# EAGLE design uArm_back_print (EAGLE 9.5.1)
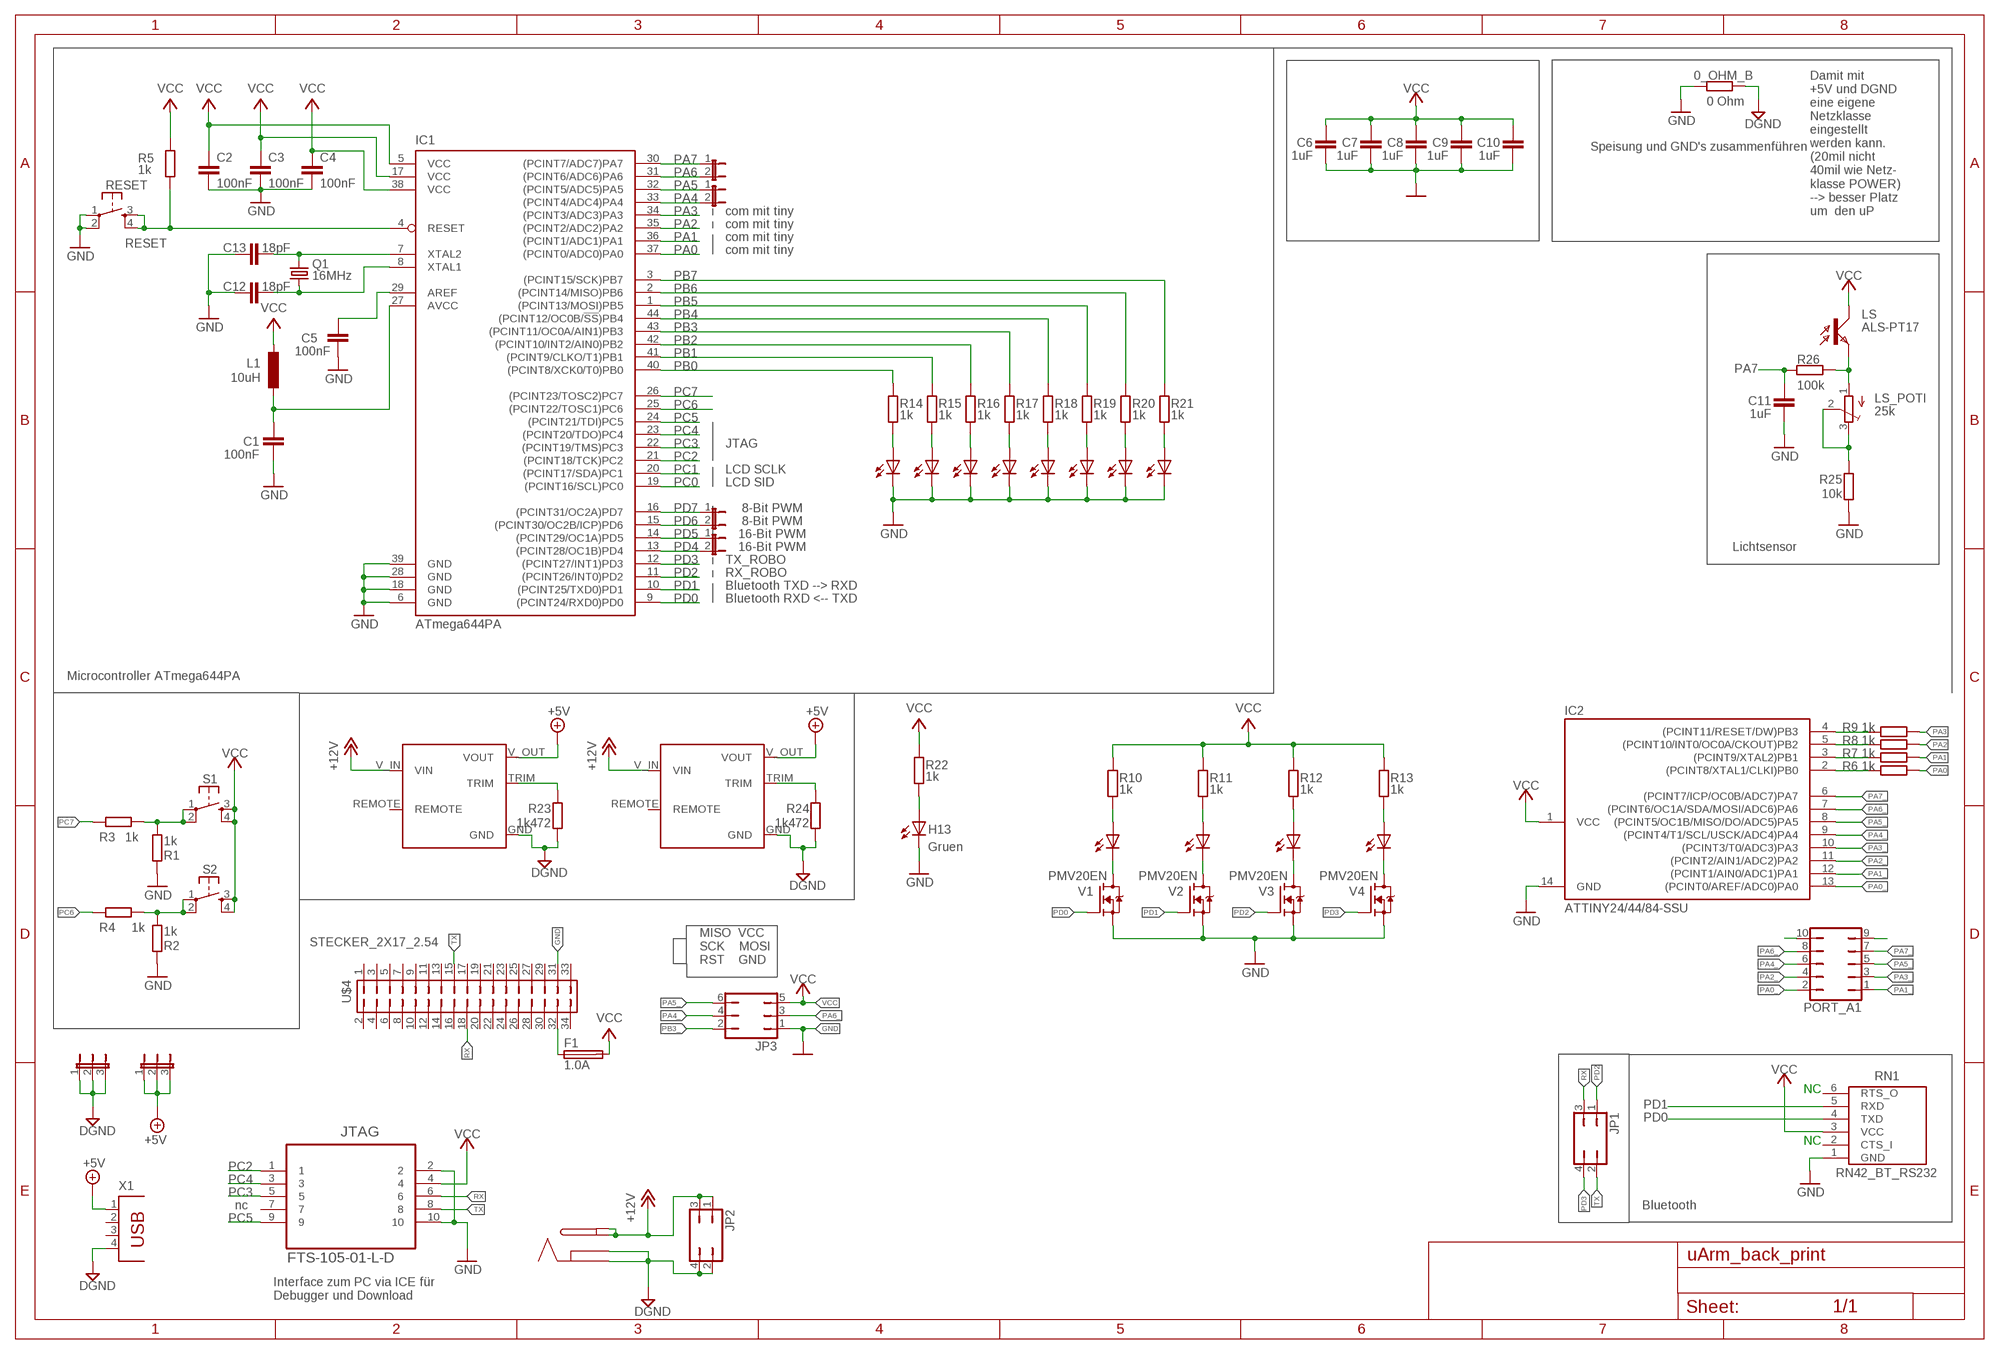
[diagram p0: schematic, sheet 1]

## Parts
0_OHM_B  0 Ohm  R-EU_R0805  [R0805]
C1  100nF  C-EUC0805  [C0805]
C2  100nF  C-EUC0805  [C0805]
C3  100nF  C-EUC0805  [C0805]
C4  100nF  C-EUC0805  [C0805]
C5  100nF  C-EUC0805  [C0805]
C6  1uF  C-EUC0805  [C0805]
C7  1uF  C-EUC0805  [C0805]
C8  1uF  C-EUC0805  [C0805]
C9  1uF  C-EUC0805  [C0805]
C10  1uF  C-EUC0805  [C0805]
C11  1uF  C-EUC0805  [C0805]
C12  18pF  C-EUC0805  [C0805]
C13  18pF  C-EUC0805  [C0805]
F1  1.0A  195601206  [F1206]
H1  Gruen  LEDCHIPLED_1206  [CHIPLED_1206]
H2  Gruen  LEDCHIPLED_1206  [CHIPLED_1206]
H3  Gruen  LEDCHIPLED_1206  [CHIPLED_1206]
H4  Gruen  LEDCHIPLED_1206  [CHIPLED_1206]
H5  Gruen  LEDCHIPLED_1206  [CHIPLED_1206]
H6  Gruen  LEDCHIPLED_1206  [CHIPLED_1206]
H7  Gruen  LEDCHIPLED_1206  [CHIPLED_1206]
H8  Gruen  LEDCHIPLED_1206  [CHIPLED_1206]
H9  Gruen  LEDCHIPLED_1206  [CHIPLED_1206]
H10  Gruen  LEDCHIPLED_1206  [CHIPLED_1206]
H11  Gruen  LEDCHIPLED_1206  [CHIPLED_1206]
H12  Gruen  LEDCHIPLED_1206  [CHIPLED_1206]
H13  Gruen  LEDCHIPLED_1206  [CHIPLED_1206]
IC1  ATmega644PA  ATMEGA644A  [TQFP44]
IC2  ATTINY24/44/84-SSU  [SOIC14]
IC3  DCDC  [1X2,3_2.54MM]
IC4  DCDC  [1X2,3_2.54MM]
JP1  JP2Q  [JP2Q]
JP2  JP2Q  [JP2Q]
JP3  JP3Q  [JP3Q]
JP4  JP1E  [JP1]
JP5  JP1E  [JP1]
JP6  JP2E  [JP2]
JP7  JP2E  [JP2]
JP8  JP1E  [JP1]
JP9  JP1E  [JP1]
JTAG  FTS-105-01-L-D  [SAMTEC_FTS-105-01-L-D]
L1  10uH  L-EUL2825P  [L2825P]
LS  ALS-PT17  ALS-PT17-51C  [SOD232-W]
LS_POTI  25k  TRIM_EU-3223G  [3223G]
PORT_A1  JP5Q  [JP5Q]
Q1  16MHz  CRYSTALHC49UP  [HC49UP]
R1  1k  R-EU_R0805  [R0805]
R2  1k  R-EU_R0805  [R0805]
R3  1k  R-EU_R0805  [R0805]
R4  1k  R-EU_R0805  [R0805]
R5  1k  R-EU_R0805  [R0805]
R6  1k  R-EU_R0805  [R0805]
R7  1k  R-EU_R0805  [R0805]
R8  1k  R-EU_R0805  [R0805]
R9  1k  R-EU_R0805  [R0805]
R10  1k  R-EU_R0805  [R0805]
R11  1k  R-EU_R0805  [R0805]
R12  1k  R-EU_R0805  [R0805]
R13  1k  R-EU_R0805  [R0805]
R14  1k  R-EU_R0805  [R0805]
R15  1k  R-EU_R0805  [R0805]
R16  1k  R-EU_R0805  [R0805]
R17  1k  R-EU_R0805  [R0805]
R18  1k  R-EU_R0805  [R0805]
R19  1k  R-EU_R0805  [R0805]
R20  1k  R-EU_R0805  [R0805]
R21  1k  R-EU_R0805  [R0805]
R22  1k  R-EU_R0805  [R0805]
R23  1k472  R-EU_R0805  [R0805]
R24  1k472  R-EU_R0805  [R0805]
R25  10k  R-EU_R0805  [R0805]
R26  100k  R-EU_R0805  [R0805]
RESET  TS42_4PAD  [TS42_4PAD]
RN1  RN42_BT_RS232  [RN42BT_RS232]
S1  TS42_4PAD  [TS42_4PAD]
S2  TS42_4PAD  [TS42_4PAD]
U$1  BUCHSE  [BUCHSE]
U$4  STECKER_2X17_2.54  [2X17_2.54]
V1  PMV20EN  BSS138  [SOT23]
V2  PMV20EN  BSS138  [SOT23]
V3  PMV20EN  BSS138  [SOT23]
V4  PMV20EN  BSS138  [SOT23]
X1  PN87520  [PN87520]

## Nets
+5V: IC3.V_OUT(VOUT) IC4.V_OUT(VOUT) JP6.1 JP6.2 JP6.3 X1.1
+12V: IC3.V_IN(VIN) IC4.V_IN(VIN) JP2.1 JP2.3 U$1.3 U$1.3.1
DGND: 0_OHM_B.2 IC3.GND IC4.GND JP2.2 JP2.4 JP7.1 JP7.2 JP7.3 R23.1 R24.1 U$1.1 U$1.2 X1.4
GND: 0_OHM_B.1 C1.1 C2.2 C3.2 C4.2 C5.1 C6.1 C7.1 C8.1 C9.1 C10.1 C11.1 C12.2 C13.1 H1.C H2.C H3.C H4.C H5.C H6.C H7.C H8.C H13.C IC1.6(GND) IC1.18(GND) IC1.28(GND) IC1.39(GND) IC2.14(GND) JP3.1 JTAG.2 JTAG.10 R1.1 R2.1 R25.1 RESET.1 RESET.2 RN1.1(GND) U$4.31 V1.2(S) V2.2(S) V3.2(S) V4.2(S)
N$1: F1.1 U$4.32
N$2: H10.C V2.3(D)
N$3: H9.C V1.3(D)
N$4: H10.A R11.1
N$5: H9.A R10.1
N$6: LS.E LS_POTI.1(A) R26.2
N$7: LS_POTI.2(S) LS_POTI.3(E) R25.2
N$8: H12.C V4.3(D)
N$9: H1.A R14.1
N$10: H12.A R13.1
N$11: H11.A R12.1
N$12: H11.C V3.3(D)
N$14: H2.A R15.1
N$15: H3.A R16.1
N$16: IC3.TRIM R23.2
N$17: H4.A R17.1
N$18: H5.A R18.1
N$19: H6.A R19.1
N$20: H7.A R20.1
N$21: R1.2 R3.2 S1.1 S1.2
N$22: R2.2 R4.2 S2.1 S2.2
N$23: H8.A R21.1
N$27: PORT_A1.9
N$28: PORT_A1.10
N$35: C1.2 IC1.27(AVCC) L1.2
N$36: C12.1 IC1.8(XTAL1) Q1.1
N$37: C13.2 IC1.7(XTAL2) Q1.2
N$38: C5.2 IC1.29(AREF)
N$60: H13.A R22.1
N$85: IC4.TRIM R24.2
PA0: IC1.37((PCINT0/ADC0)PA0) R6.1
PA0_: IC2.13((PCINT0/AREF/ADC0)PA0) PORT_A1.2
PA1: IC1.36((PCINT1/ADC1)PA1) R7.1
PA1_: IC2.12((PCINT1/AIN0/ADC1)PA1) PORT_A1.1
PA2: IC1.35((PCINT2/ADC2)PA2) R8.1
PA2_: IC2.11((PCINT2/AIN1/ADC2)PA2) PORT_A1.4
PA3: IC1.34((PCINT3/ADC3)PA3) R9.1
PA3_: IC2.10((PCINT3/T0/ADC3)PA3) PORT_A1.3
PA4: IC1.33((PCINT4/ADC4)PA4) JP9.2
PA4_: IC2.9((PCINT4/T1/SCL/USCK/ADC4)PA4) JP3.4 PORT_A1.6
PA5: IC1.32((PCINT5/ADC5)PA5) JP9.1
PA5_: IC2.8((PCINT5/OC1B/MISO/DO/ADC5)PA5) JP3.6 PORT_A1.5
PA6: IC1.31((PCINT6/ADC6)PA6) JP8.2
PA6_: IC2.7((PCINT6/OC1A/SDA/MOSI/ADC6)PA6) JP3.3 PORT_A1.8
PA7: C11.2 IC1.30((PCINT7/ADC7)PA7) JP8.1 R26.1
PA7_: IC2.6((PCINT7/ICP/OC0B/ADC7)PA7) PORT_A1.7
PB0: IC1.40((PCINT8/XCK0/T0)PB0) R14.2
PB0_: IC2.2((PCINT8/XTAL1/CLKI)PB0) R6.2
PB1: IC1.41((PCINT9/CLKO/T1)PB1) R15.2
PB1_: IC2.3((PCINT9/XTAL2)PB1) R7.2
PB2: IC1.42((PCINT10/INT2/AIN0)PB2) R16.2
PB2_: IC2.5((PCINT10/INT0/OC0A/CKOUT)PB2) R8.2
PB3: IC1.43((PCINT11/OC0A/AIN1)PB3) R17.2
PB3_: IC2.4((PCINT11/RESET/DW)PB3) JP3.2 R9.2
PB4: IC1.44((PCINT12/OC0B/!SS!)PB4) R18.2
PB5: IC1.1((PCINT13/MOSI)PB5) R19.2
PB6: IC1.2((PCINT14/MISO)PB6) R20.2
PB7: IC1.3((PCINT15/SCK)PB7) R21.2
PC0: IC1.19((PCINT16/SCL)PC0)
PC1: IC1.20((PCINT17/SDA)PC1)
PC2: IC1.21((PCINT18/TCK)PC2) JTAG.1
PC3: IC1.22((PCINT19/TMS)PC3) JTAG.5
PC4: IC1.23((PCINT20/TDO)PC4) JTAG.3
PC5: IC1.24((PCINT21/TDI)PC5) JTAG.9
PC6: IC1.25((PCINT22/TOSC1)PC6) R4.1
PC7: IC1.26((PCINT23/TOSC2)PC7) R3.1
PD0: IC1.9((PCINT24/RXD0)PD0) RN1.4(TXD) V1.1(G)
PD1: IC1.10((PCINT25/TXD0)PD1) RN1.5(RXD) V2.1(G)
PD2: IC1.11((PCINT26/INT0)PD2) JP1.1 V3.1(G)
PD3: IC1.12((PCINT27/INT1)PD3) JP1.4 V4.1(G)
PD4: IC1.13((PCINT28/OC1B)PD4) JP4.2
PD5: IC1.14((PCINT29/OC1A)PD5) JP4.1
PD6: IC1.15((PCINT30/OC2B/ICP)PD6) JP5.2
PD7: IC1.16((PCINT31/OC2A)PD7) JP5.1
RESET: IC1.4(RESET) R5.1 RESET.3 RESET.4
RX: JP1.3 JTAG.6 U$4.18
TX: JP1.2 JTAG.8 U$4.15
VCC: C2.1 C3.1 C4.1 C6.2 C7.2 C8.2 C9.2 C10.2 F1.2 IC1.5(VCC) IC1.17(VCC) IC1.38(VCC) IC2.1(VCC) JP3.5 JTAG.4 L1.1 LS.C R5.2 R10.2 R11.2 R12.2 R13.2 R22.2 RN1.3(VCC) S1.3 S1.4 S2.3 S2.4
Unconnected: IC3.REMOTE IC4.REMOTE JTAG.7 RN1.2(CTS_I) RN1.6(RTS_O) U$4.1 U$4.2 U$4.3 U$4.4 U$4.5 U$4.6 U$4.7 U$4.8 U$4.9 U$4.10 U$4.11 U$4.12 U$4.13 U$4.14 U$4.16 U$4.17 U$4.19 U$4.20 U$4.21 U$4.22 U$4.23 U$4.24 U$4.25 U$4.26 U$4.27 U$4.28 U$4.29 U$4.30 U$4.33 U$4.34 X1.2 X1.3

## Notes on the sheet
- Speisung und GND's zusammenführen
- com mit tiny
- Damit mit
  +5V und DGND
  eine eigene 
  Netzklasse
  eingestellt
  werden kann.
  (20mil nicht
  40mil wie Netz-
  klasse POWER)
  --> besser Platz 
  um  den uP
- com mit tiny
- com mit tiny
- com mit tiny
- JTAG
- LCD SCLK
- LCD SID
- 8-Bit PWM
- 8-Bit PWM
- 16-Bit PWM
- 16-Bit PWM | Lichtsensor
- TX_ROBO
- RX_ROBO
- Bluetooth TXD --> RXD
- Bluetooth RXD <-- TXD
- Microcontroller ATmega644PA
- MISO  VCC
  SCK    MOSI
  RST    GND
- NC
- NC
- nc | Bluetooth
- Interface zum PC via ICE für
  Debugger und Download

## Library data of the parts
0_OHM_B R1-R26 = rcl:R-EU_: RESISTOR, European symbol; SPICEPREFIX: R
C1-C13 = rcl:C-EU: CAPACITOR, European symbol; SPICEPREFIX: C
F1 = fuse:19560: FUSE HOLDER TR5, Wickmann
H1-H13 = led:LED: LED OSRAM: - CHIPLED LG R971, LG N971, LY N971, LG Q971, LY Q971, LO R971, LY R971 LH N974, LH R974 LS Q976, LO Q976, LY Q976 LO Q996 - Hyper CHIPLED LW Q18S LB Q993, LB Q99A, LB R99A - SideLED LS A670, LO A670, LY A670, LG A670, LP A670 LB A673, LV A673, LT A673, LW A673 LH A674 LY A675 LS A676, LA A676, LO A676, LY A676, LW A676 LS A679, LY A679, LG A679 - Hyper Micro SIDELED® LS Y876, LA Y876, LO Y876, LY Y876 LT Y87S - SmartLED LW L88C, LW L88S LB L89C, LB L89S, LG L890 LS L89K, LO L89K, LY L89K LS L896, LA L896, LO L896, LY L896 - TOPLED LS T670, LO T670, LY T670, LG T670, LP T670 LSG T670, LSP T670, LSY T670, LOP T670, LYG T670 LG T671, LOG T671, LSG T671 LB T673, LV T673, LT T673, LW T673 LH T674 LS T676, LA T676, LO T676, LY T676, LB T676, LH T676, LSB T676, LW T676 LB T67C, LV T67C, LT T67C, LS T67K, LO T67K, LY T67K, LW E67C LS E67B, LA E67B, LO E67B, LY E67B, LB E67C, LV E67C, LT E67C LW T67C LS T679, LY T679, LG T679 LS T770, LO T770, LY T770, LG T770, LP T770 LB T773, LV T773, LT T773, LW T773 LH T774 LS E675, LA E675, LY E675, LS T675 LS T776, LA T776, LO T776, LY T776, LB T776 LHGB T686 LT T68C, LB T68C - Hyper Mini TOPLED® LB M676 - Mini TOPLED Santana® LG M470 LS M47K, LO M47K, LY M47K Source: http://www.osram.convergy.de LUXEON: - LUMILED® LXK2-PW12-R00, LXK2-PW12-S00, LXK2-PW14-U00, LXK2-PW14-V00 LXK2-PM12-R00, LXK2-PM12-S00, LXK2-PM14-U00 LXK2-PE12-Q00, LXK2-PE12-R00, LXK2-PE12-S00, LXK2-PE14-T00, LXK2-PE14-U00 LXK2-PB12-K00, LXK2-PB12-L00, LXK2-PB12-M00, LXK2-PB14-N00, LXK2-PB14-P00, LXK2-PB14-Q00 LXK2-PR12-L00, LXK2-PR12-M00, LXK2-PR14-Q00, LXK2-PR14-R00 LXK2-PD12-Q00, LXK2-PD12-R00, LXK2-PD12-S00 LXK2-PH12-R00, LXK2-PH12-S00 LXK2-PL12-P00, LXK2-PL12-Q00, LXK2-PL12-R00 Source: www.luxeon.com KINGBRIGHT: KA-3528ASYC Source: www.kingbright.com
IC1 = atmel:ATMEGA644: 8-bit Microcontroller with 64K Bytes In-System Programmable Flash Source: http://www.atmel.com/dyn/resources/prod_documents/doc2593.pdf; MPN: ATMEGA644PV-10AU; OC_FARNELL: 1455123; OC_NEWARK: 58M3748
IC2 = attiny24_44_84:ATTINY24/44/84
IC3 IC4 = untitled:DCDC
JP1 JP2 = jumper:JP2Q: JUMPER
JP3 = jumper:JP3Q: JUMPER
JP4 JP5 JP8 JP9 = jumper:JP1E: JUMPER
JP6 JP7 = jumper:JP2E: JUMPER
JTAG = JTAG_10pol_50mil:FTS-105-01-L-D; DESCRIPTION: CONN HEADER, 1.27MM, THRU HOLE, 10WAY; MPN: FTS-105-01-L-D; OCFARNELL: 1667728; OCNEWARK: 11P4652; PACKAGE: HEADER, 1.27MM, THRU HOLE, 10WAY; SUPPLIER: Samtec
L1 = rcl:L-EU: INDUCTOR, European symbol
LS = Lichtsensor:ALS-PT17-51C
LS_POTI = pot:TRIM_EU-: POTENTIOMETER
PORT_A1 = jumper:JP5Q: JUMPER
Q1 = crystal:CRYSTAL: CRYSTAL; OC_FARNELL: unknown; OC_NEWARK: unknown
RESET S1 S2 = SmartPrj:TS42_4PAD
RN1 = RN42_BT_RS232:RN42_BT_RS232
U$1 = untitled:BUCHSE
U$4 = untitled:STECKER_2X17_2.54
V1-V4 = transistor-fet-mit-BSS138:BSS138
X1 = con-berg:PN87520: BERG USB connector; OC_FARNELL: unknown; OC_NEWARK: unknown

## Net classes
0 default: width 0.254 mm, drill 0.508 mm
1 POWER: width 1.016 mm, drill 1.016 mm

## Board
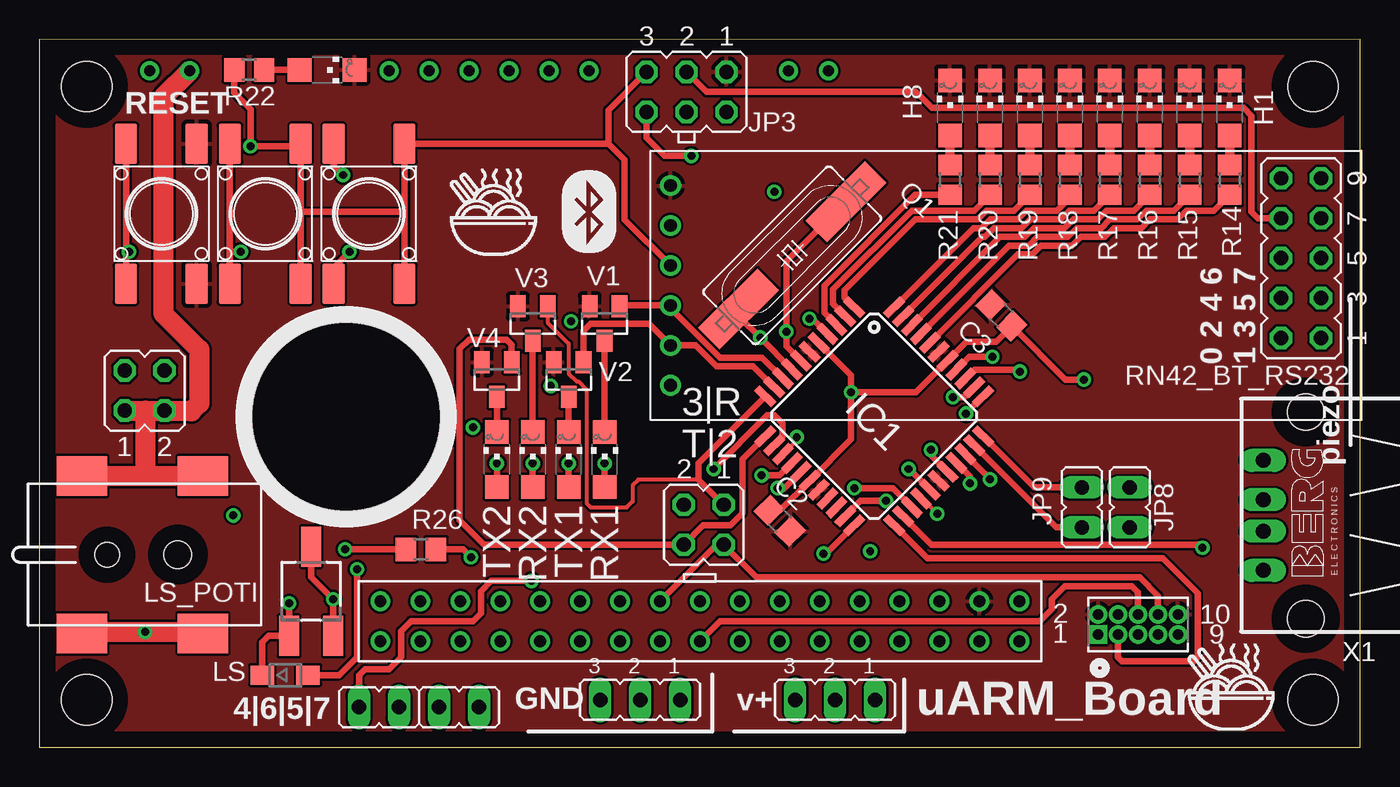
[diagram p1: board, top side]
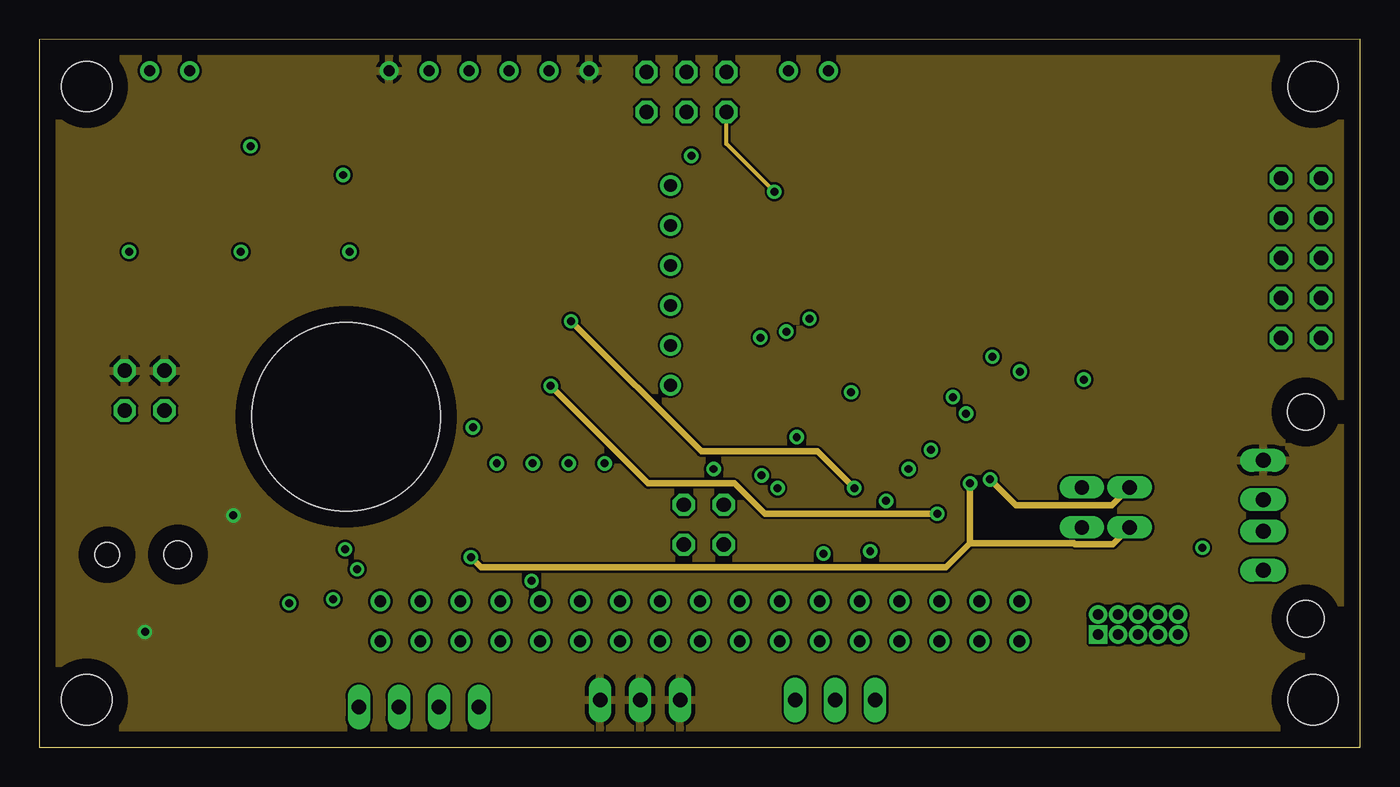
[diagram p2: board, inner layer Route2]
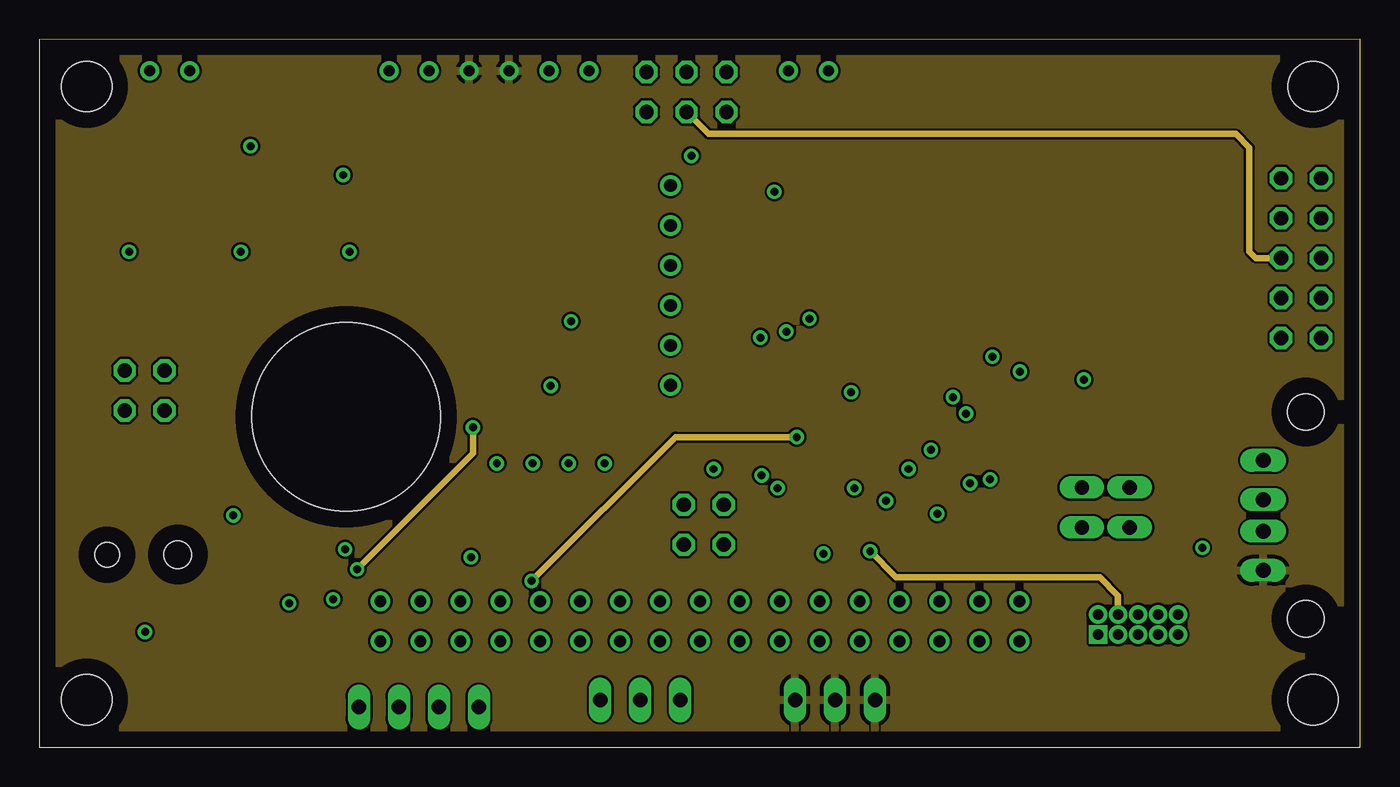
[diagram p3: board, inner layer Route15]
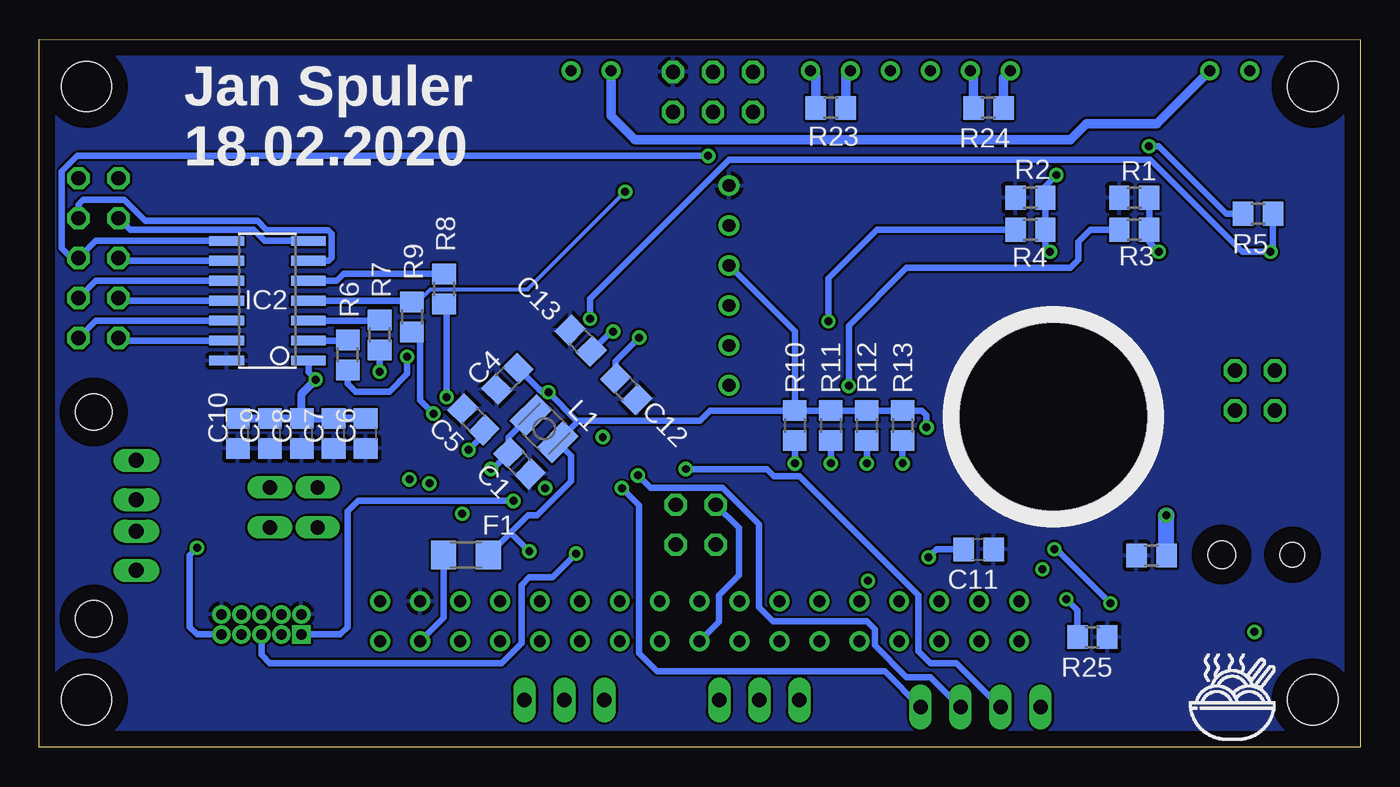
[diagram p4: board, bottom side, seen from below]

Size 84.02 x 45.02 mm. Coordinates in mm from the lower left corner, seen from the top.
Outline: 0,0 84.02,0.02 84.02,45.02 0,45 0,0
Copper layers (1+2*15+16): Top 0.035mm / dielectric 1.5mm / Route2 0.035mm / dielectric 0.15mm / Route15 0.035mm / dielectric 0.2mm / Bottom 0.035mm
Design rules "default *": minimum track width 6mil, minimum drill 0.35mm, track to track 6mil, track to pad 6mil, pad to pad 6mil, via to via 6mil, smd to smd 6mil, copper to edge 40mil, drill to drill 6mil, minimum pad ring 10mil, minimum via ring 8mil, stop-mask expansion 4mil, vias tented up to drill 0mil, thermal gap 10mil
Holes 12 mm at 19.52,21.02
Holes 3.2 mm at 3.02,42.02 3.02,3.02 81.02,3.02 81.02,42.02

### Footprints (pad centres in the part's own frame; a part is rotated, then mirrored left to right if it is on the bottom)
R0805 = smd 1.3 x 1.5: 1 -0.95,0; 2 0.95,0
C0805 = smd 1.3 x 1.5: 1 -0.95,0; 2 0.95,0
F1206 = smd 1.6 x 1.803: 1 -1.422,0; 2 1.422,0
CHIPLED_1206 = smd 1.5 x 1.5: A 0,-1.75; C 0,1.75
TQFP44 = smd 1.5 x 0.5: 1 -5.8,4; 2 -5.8,3.2; 3 -5.8,2.4; 4 -5.8,1.6; 5 -5.8,0.8; 6 -5.8,0; 7 -5.8,-0.8; 8 -5.8,-1.6; 9 -5.8,-2.4; 10 -5.8,-3.2; 11 -5.8,-4; 23 5.8,-4; 24 5.8,-3.2; 25 5.8,-2.4; 26 5.8,-1.6; 27 5.8,-0.8; 28 5.8,0; 29 5.8,0.8; 30 5.8,1.6; 31 5.8,2.4; 32 5.8,3.2; 33 5.8,4 | smd 0.5 x 1.5: 12 -4,-5.8; 13 -3.2,-5.8; 14 -2.4,-5.8; 15 -1.6,-5.8; 16 -0.8,-5.8; 17 0,-5.8; 18 0.8,-5.8; 19 1.6,-5.8; 20 2.4,-5.8; 21 3.2,-5.8; 22 4,-5.8; 34 4,5.8; 35 3.2,5.8; 36 2.4,5.8; 37 1.6,5.8; 38 0.8,5.8; 39 0,5.8; 40 -0.8,5.8; 41 -1.6,5.8; 42 -2.4,5.8; 43 -3.2,5.8; 44 -4,5.8
SOIC14 = smd 0.61 x 2.21: 1 -3.81,-2.603; 2 -2.54,-2.603; 3 -1.27,-2.603; 4 0,-2.603; 5 1.27,-2.603; 6 2.54,-2.603; 7 3.81,-2.603; 8 3.81,2.603; 9 2.54,2.603; 10 1.27,2.603; 11 0,2.603; 12 -1.27,2.603; 13 -2.54,2.603; 14 -3.81,2.603
1X2,3_2.54MM = drill 0.7: GND 15.24,0; REMOTE 0,0; TRIM 17.78,0; V_IN 2.54,0; V_OUT 20.32,0
JP2Q = drill 0.914 octagon: 1 -1.27,-1.27; 2 -1.27,1.27; 3 1.27,-1.27; 4 1.27,1.27
JP3Q = drill 0.914 octagon: 1 -2.54,-1.27; 2 -2.54,1.27; 3 0,-1.27; 4 0,1.27; 5 2.54,-1.27; 6 2.54,1.27
JP1 = drill 0.914 long: 1 0,-1.27; 2 0,1.27
JP2 = drill 0.914 long: 1 -2.54,0; 2 0,0; 3 2.54,0
SAMTEC_FTS-105-01-L-D = drill 0.66 square: 1 -5.08,-1.27 | drill 0.66: 2 -5.08,0; 3 -3.81,-1.27; 4 -3.81,0; 5 -2.54,-1.27; 6 -2.54,0; 7 -1.27,-1.27; 8 -1.27,0; 9 0,-1.27; 10 0,0
L2825P = smd 1.4 x 2.4: 1 -1.2,0; 2 1.2,0
SOD232-W = smd 1.5 x 1.2: C 1.45,0; E -1.45,0
3223G = smd 2.54 x 1.27: 1 -2.835,1.4; 2 2.835,0; 3 -2.835,-1.4
JP5Q = drill 0.914 octagon: 1 -5.08,-1.27; 2 -5.08,1.27; 3 -2.54,-1.27; 4 -2.54,1.27; 5 0,-1.27; 6 0,1.27; 7 2.54,-1.27; 8 2.54,1.27; 9 5.08,-1.27; 10 5.08,1.27
HC49UP = smd 5.334 x 1.93: 1 -4.826,0; 2 4.826,0
TS42_4PAD = smd 2.54 x 1.4: 1 -4.454,2.25; 2 4.454,2.25; 3 -4.454,-2.25; 4 4.454,-2.25
RN42BT_RS232 = drill 0.8: 1 22.86,-6.35; 2 22.86,-3.81; 3 22.86,-1.27; 4 22.86,1.27; 5 22.86,3.81; 6 22.86,6.35
BUCHSE = smd 3.2 x 2.5: 1 6.1,-5; 2 -1.6,-5; 3 -1.6,5; 3.1 6.1,5 | hole 1.75: 4.5,0 | hole 1.55: 0,0
2X17_2.54 = drill 0.75: 1 -20.32,1.27; 2 -20.32,-1.27; 3 -17.78,1.27; 4 -17.78,-1.27; 5 -15.24,1.27; 6 -15.24,-1.27; 7 -12.7,1.27; 8 -12.7,-1.27; 9 -10.16,1.27; 10 -10.16,-1.27; 11 -7.62,1.27; 12 -7.62,-1.27; 13 -5.08,1.27; 14 -5.08,-1.27; 15 -2.54,1.27; 16 -2.54,-1.27; 17 0,1.27; 18 0,-1.27; 19 2.54,1.27; 20 2.54,-1.27; 21 5.08,1.27; 22 5.08,-1.27; 23 7.62,1.27; 24 7.62,-1.27; 25 10.16,1.27; 26 10.16,-1.27; 27 12.7,1.27; 28 12.7,-1.27; 29 15.24,1.27; 30 15.24,-1.27; 31 17.78,1.27; 32 17.78,-1.27; 33 20.32,1.27; 34 20.32,-1.27
SOT23 = smd 1 x 1.4: 1 -0.95,-1.1; 2 0.95,-1.1; 3 0,1.1
PN87520 = drill 0.95 long: 1 -3.5,2.71; 2 -1,2.71; 3 1,2.71; 4 3.5,2.71 | hole 2.3: -6.57,0; 6.57,0

### Placement (x,y rotation side)
0_OHM_B  13.27,12.19 0 bottom
C1  53.49,18.05 135 bottom
C2  47.09,14.4 315 top
C3  61.2,27.46 135 top
C4  54.25,23.44 225 bottom
C5  56.41,20.85 315 bottom
C6  63.27,19.96 90 bottom
C7  65.3,19.96 90 bottom
C8  67.33,19.96 90 bottom
C9  69.36,19.96 90 bottom
C10  71.39,19.96 90 bottom
C11  24.28,12.59 180 bottom
C12  46.69,22.79 315 bottom
C13  49.58,25.86 315 bottom
F1  56.88,12.23 0 bottom
H1  75.71,40.66 0 top
H2  73.17,40.66 0 top
H3  70.63,40.66 0 top
H4  68.09,40.66 0 top
H5  65.55,40.66 0 top
H6  63.01,40.66 0 top
H7  60.47,40.66 0 top
H8  57.93,40.66 0 top
H9  35.96,18.31 0 top
H10  33.67,18.31 0 top
H11  31.39,18.31 0 top
H12  29.1,18.31 0 top
H13  18.31,43.07 270 top
IC1  53.11,21.05 315 top
IC2  69.5,28.4 90 bottom
IC3  50.2,43.02 180 top
IC4  7.02,43.02 0 top
JP1  42.26,14.16 180 top
JP2  6.7,22.69 0 top
JP3  41.17,41.68 180 top
JP4  21.61,2.56 270 top
JP5  26.69,2.56 90 top
JP6  50.62,3.02 180 top
JP7  38.22,3.02 180 top
JP8  69.36,15.26 0 top
JP9  66.31,15.26 0 top
JTAG  72.43,8.45 0 top
L1  51.9,20.26 135 bottom
LS  15.64,4.59 0 top
LS_POTI  17.29,9.93 90 top
PORT_A1  80.25,31.1 90 top
Q1  47.89,31.29 45 top
R1  14.37,34.94 0 bottom
R2  20.97,34.94 0 bottom
R3  14.37,32.91 0 bottom
R4  20.97,32.91 0 bottom
R5  6.5,33.93 180 bottom
R6  64.4,24.95 90 bottom
R7  62.37,26.22 90 bottom
R8  58.27,29.14 90 bottom
R9  60.32,27.37 90 bottom
R10  35.96,20.47 90 bottom
R11  33.67,20.47 90 bottom
R12  31.39,20.47 90 bottom
R13  29.1,20.47 90 bottom
R14  75.71,36.09 270 top
R15  73.17,36.09 270 top
R16  70.63,36.09 270 top
R17  68.09,36.09 270 top
R18  65.55,36.09 270 top
R19  63.01,36.09 270 top
R20  60.47,36.09 270 top
R21  57.93,36.09 270 top
R22  13.35,43.07 180 top
R23  33.67,40.66 0 bottom
R24  23.64,40.66 180 bottom
R25  17.04,7 180 bottom
R26  24.28,12.59 180 top
RESET  7.77,33.93 270 top
RN1  63.01,29.37 180 top
S1  14.37,33.93 90 top
S2  20.97,33.93 90 top
U$1  4.31,12.25 0 top
U$4  42.02,8.02 0 top
V1  35.96,26.94 180 top
V2  33.67,23.39 180 top
V3  31.39,26.94 180 top
V4  29.1,23.39 180 top
X1  80.56,14.75 90 top

### Tracks (layer width: path | path; a pad name or v marks a point on that pad's centre or on a via)
+5V
  pour Route15: -18.03,64.79 91.55,64.79 91.55,-21.81 -18.03,-21.81
+12V
  Top 1.27: JP2.1 6.75,21.42 | 6.75,21.42 JP2.3 8.03,21.36 9.67,21.36 10.18,21.86 10.18,25.29 7.89,27.58 7.89,41.35 IC4.V_IN | 6.75,21.42 6.75,17.25 | 6.75,17.25 U$1.3 | U$1.3.1 6.75,17.25
  Bottom 0.61: IC4.V_IN 12.94,39.64 17.42,39.64 18.43,38.63 46.12,38.63 47.66,40.17 IC3.V_IN
DGND  (via drill 0.51)
  Top 0.254: 2.86,7.33 U$1.2 | 10.38,7.33 U$1.1
  Top 1.27: U$1.2 2.8,7.33 v6.73,7.33 10.38,7.33
  Bottom 0.61: R24.1 22.69,42.59 IC4.GND | R23.1 34.62,42.68 IC3.GND
  Bottom 1.016: 0_OHM_B.2 12.32,14.74 v12.34,14.75
  pour Route2: -18.31,81.17 92.46,81.17 92.46,-33.6 -18.31,-33.6
GND
  pour Top: -14.16,55.57 88.88,55.57 88.88,-7.91 -14.16,-7.91
  pour Bottom: -7.42,55.14 -7.42,-18.78 89.52,-18.78 89.52,55.14
N$1
  Bottom 0.406: F1.1 58.3,8.25 U$4.32
N$2
  Top 0.406: V2.3 H10.C
N$3
  Top 0.406: V1.3 H9.C
N$4  (via drill 0.51)
  Top 0.406: H10.A v33.67,18.05
  Bottom 0.406: v33.67,18.05 R11.1
N$5  (via drill 0.51)
  Top 0.406: H9.A v35.96,18.05
  Bottom 0.406: v35.96,18.05 R10.1
N$6  (via drill 0.51)
  Top 0.406: LS.E 14.19,6.7 14.58,7.09 LS_POTI.1 v15.89,9.16 | v19.45,12.59 R26.2
  Bottom 0.406: v15.89,9.16 19.32,12.59 v19.45,12.59
N$7  (via drill 0.51)
  Top 0.406: LS_POTI.3 v18.69,9.41 17.29,10.81 LS_POTI.2
  Bottom 0.406: R25.2 17.99,8.71 v18.69,9.41
N$8
  Top 0.406: V4.3 H12.C
N$9
  Top 0.61: R14.1 H1.A
N$10  (via drill 0.51)
  Top 0.406: H12.A v29.1,18.05
  Bottom 0.406: v29.1,18.05 R13.1
N$11  (via drill 0.51)
  Top 0.406: H11.A v31.39,18.05
  Bottom 0.406: v31.39,18.05 R12.1
N$12
  Top 0.406: V3.3 H11.C
N$14
  Top 0.61: H2.A R15.1
N$15
  Top 0.61: H3.A R16.1
N$16
  Bottom 0.61: R23.2 32.72,42.71 IC3.TRIM
N$17
  Top 0.61: H4.A R17.1
N$18
  Top 0.61: H5.A R18.1
N$19
  Top 0.61: H6.A R19.1
N$20
  Top 0.61: H7.A R20.1
N$21  (via drill 0.51)
  Top 0.254: 12.01,29.48 S1.1
  Top 0.406: S1.2 12.12,31.52 | 12.12,31.52 12.12,29.6 12.01,29.48 | v12.82,31.52 12.12,31.52
  Bottom 0.254: 13.43,32.94 R3.2
  Bottom 0.406: R3.2 13.42,32.11 v12.82,31.52 | R1.2 13.42,32.95 13.43,32.94
N$22  (via drill 0.51)
  Top 0.406: S2.1 18.72,30.51 v19.73,31.52 | v19.32,36.39 18.72,36.99 S2.2
  Bottom 0.406: v19.73,31.52 20.02,31.81 R4.2 R2.2 20.02,35.69 v19.32,36.39
N$23
  Top 0.61: R21.1 H8.A
N$35  (via drill 0.51)
  Top 0.406: IC1.27 55.33,17.7 v55.29,17.7
  Bottom 0.406: v55.29,17.7 55.19,17.7 C1.2 54.16,19.7 L1.2
N$36  (via drill 0.51)
  Top 0.406: IC1.8 45.87,26.03 | 45.87,26.03 v45.87,26.05 | Q1.1 44.48,27.42 45.87,26.03
  Bottom 0.406: C12.1 47.36,24.56 v45.87,26.05
N$37  (via drill 0.51)
  Top 0.406: IC1.7 47.52,25.51 v47.52,26.44 47.52,30.91 Q1.2
  Bottom 0.406: C13.2 47.66,26.44 v47.52,26.44
N$38  (via drill 0.51)
  Top 0.406: IC1.29 56.71,18.58 v56.71,18.92
  Bottom 0.406: C5.2 55.74,19.89 v56.71,18.92
N$60
  Top 0.406: R22.1 H13.A
N$85
  Bottom 0.61: R24.2 24.59,42.81 IC4.TRIM
PA0  (via drill 0.51)
  Top 0.406: IC1.37 59.15,24.84 v60.62,24.84
  Bottom 0.406: R6.1 64.4,23.13 63.9,22.63 61.74,22.63 60.62,23.74 v60.62,24.84
PA0_
  Bottom 0.406: IC2.13 78.82,25.86 PORT_A1.2
PA1  (via drill 0.51)
  Top 0.406: IC1.36 59.47,24.02 62.25,24.02 v62.38,23.9
  Bottom 0.406: R7.1 v62.37,23.9 v62.38,23.9
PA1_
  Bottom 0.406: IC2.12 80.42,27.13 PORT_A1.1
PA2  (via drill 0.51)
  Top 0.406: IC1.35 58.85,22.27 v58.11,22.27
  Bottom 0.406: v58.11,22.27 58.11,28.03 R8.1
PA2_
  Bottom 0.406: IC2.11 78.82,28.4 PORT_A1.4
PA3  (via drill 0.51)
  Top 0.406: v58.95,21.22 58.95,21.24 IC1.34
  Bottom 0.406: R9.1 59.81,25.91 59.81,22.08 v58.95,21.22
PA3_
  Bottom 0.406: IC2.10 80.42,29.67 PORT_A1.3
PA4
  Top 0.406: IC1.33 63.29,16.53 JP9.2
PA4_
  Route15 0.406: JP3.4 42.56,39.01 76.09,39.01 76.98,38.12 76.98,31.52 77.39,31.1 PORT_A1.6
  Bottom 0.406: IC2.9 78.82,30.94 PORT_A1.6
PA5
  Top 0.406: IC1.32 64.7,13.99 JP9.1
PA5_  (via drill 0.51)
  Top 0.406: JP3.6 38.63,38.75 39.77,37.61 v41.47,37.61
  Bottom 0.406: v41.47,37.61 81.6,37.61 82.59,36.63 82.59,31.75 81.95,31.1 PORT_A1.5 80.42,32.21 IC2.8
PA6  (via drill 0.51)
  Top 0.406: IC1.31 60.47,17.08 v60.47,17.04
  Route2 0.406: v60.47,17.04 62.12,15.39 68.22,15.39 JP8.2
PA6_
  Top 0.406: JP3.3 42.44,41.68 55.77,41.68 56.79,40.66 76.6,40.66 77.11,40.15 77.11,34.06 77.52,33.64 PORT_A1.8
  Bottom 0.406: IC2.7 69.67,32.21 70.38,32.91 78.25,32.91 PORT_A1.8
PA7  (via drill 0.51)
  Top 0.406: IC1.30 59.2,17.22 v59.2,16.78 | C11.2 26.94,12.59 v27.45,12.08
  Route2 0.406: v27.45,12.08 28.09,11.45 57.68,11.45 59.2,12.97 | v59.2,16.78 59.2,12.97 | 59.2,12.97 65.82,12.97 65.87,12.92 68.29,12.92 JP8.1
  Bottom 0.406: C11.2 26.94,12.59 v27.45,12.08
PA7_
  Bottom 0.406: IC2.6 65.62,30.94 65.42,31.13 65.42,32.64 65.65,32.87 69.54,32.87 70.15,33.47 77.29,33.47 78.63,34.82 81.24,34.82 81.52,34.53 PORT_A1.7
PB0
  Top 0.406: IC1.40 62.26,31.34 63.16,31.34 63.72,31.9 65.68,31.9 66.24,32.46 67.78,32.46 68.34,33.01 70.09,33.01 70.65,33.57 72.4,33.57 72.96,34.13 74.71,34.13 R14.2
PB0_
  Bottom 0.406: IC2.2 64.45,25.86 R6.2
PB1
  Top 0.406: IC1.41 61.69,31.9 62.93,31.9 63.49,32.46 65.43,32.46 65.99,33.01 67.55,33.01 68.11,33.57 69.86,33.57 70.42,34.13 72.17,34.13 R15.2
PB1_
  Bottom 0.406: IC2.3 62.42,27.13 R7.2
PB2
  Top 0.406: IC1.42 61.12,32.46 62.7,32.46 63.26,33.01 65.2,33.01 65.76,33.57 67.32,33.57 67.88,34.13 69.63,34.13 R16.2
PB2_
  Bottom 0.406: IC2.5 65.11,29.67 64.66,30.12 58.3,30.12 R8.2
PB3
  Top 0.406: IC1.43 59.98,32.46 60.16,32.46 60.72,33.01 62.47,33.01 63.03,33.57 64.97,33.57 65.53,34.13 67.09,34.13 R17.2
PB3_  (via drill 0.51)
  Route2 0.254: v46.76,35.33 43.71,38.37 JP3.2
  Bottom 0.254: R9.2 59.95,28.32 59.14,29.12 52.96,29.12 v46.76,35.33
  Bottom 0.406: IC2.4 60.4,28.4 R9.2
PB4
  Top 0.406: IC1.44 59.41,33.01 59.93,33.01 60.49,33.57 62.24,33.57 62.8,34.13 64.74,34.13 65.55,34.94 R18.2
PB5
  Top 0.406: IC1.1 51.23,28.59 51.23,29.07 55.73,33.57 59.7,33.57 60.26,34.13 62.01,34.13 R19.2
PB6
  Top 0.406: IC1.2 50.49,28.2 50.49,29.13 55.5,34.13 59.47,34.13 R20.2
PB7
  Top 0.406: IC1.3 49.93,27.62 49.93,29.36 55.71,35.14 R21.2
PC2  (via drill 0.51)
  Top 0.406: IC1.21 52.25,15.67 v53.87,15.67
  Bottom 0.406: v53.87,15.67 63.75,15.67 64.41,15.01 64.41,7.64 64.87,7.18 JTAG.1
PC3  (via drill 0.51)
  Top 0.406: IC1.22 50.02,12.31 v49.88,12.31
  Bottom 0.406: JTAG.5 69.89,5.88 69.36,5.35 54.63,5.35 53.36,6.62 53.36,10.31 52.85,10.81 51.38,10.81 v49.88,12.31
PC4
  Top 0.406: JTAG.3 68.62,5.71 68.85,5.48 73.43,5.48 73.68,5.73 73.68,9.8 71.47,12.01 56.5,12.01 IC1.23
PC5  (via drill 0.51)
  Top 0.406: IC1.24 56.74,12.9 73.78,12.9 v73.98,12.69
  Bottom 0.406: JTAG.9 73.98,7.18 74.44,7.64 74.44,12.21 73.98,12.67 v73.98,12.69
PC6  (via drill 0.51)
  Top 0.406: IC1.25 54.29,16.48 v51.84,16.48
  Route2 0.406: v33.83,27.1 42.11,18.82 49.5,18.82 v51.84,16.48
  Bottom 0.406: R4.1 30.75,32.91 33.83,29.84 v33.83,27.1
PC7  (via drill 0.51)
  Top 0.254: v57.12,14.85 56.1,15.87 IC1.26
  Route2 0.406: v32.53,22.98 38.73,16.78 44.22,16.78 46.15,14.85 v57.12,14.85
  Bottom 0.406: v32.53,22.98 32.53,26.82 28.85,30.5 18.43,30.5 17.93,31.01 17.93,32.15 17.16,32.91 R3.1
PD0
  Top 0.406: V1.1 36.97,28.1 RN1.4 40.15,27.93 43.29,24.78 45.98,24.78 IC1.9
PD1
  Top 0.406: V2.1 34.62,26.5 35.07,26.94 38.77,26.94 RN1.5 41.73,25.56 43.06,24.23 45.41,24.23 IC1.10
PD2
  Top 0.254: V3.1 32.34,27.01 33.67,25.67 33.67,23.77 34.18,23.27 34.29,23.27 34.82,22.74 34.82,15.51 35.07,15.26 37.36,15.26 37.74,15.64 37.74,16.66 38.11,17.03 41.93,17.03
  Top 0.406: IC1.11 41.93,18.08 41.93,17.03 JP1.1
PD3
  Top 0.406: V4.1 30.05,25.61 29.74,25.93 27.32,25.93 26.74,25.34 26.74,14.45 28.3,12.89 JP1.4 42.22,14.12 43.96,14.12 44.72,14.88 44.72,18.33 IC1.12
PD4  (via drill 0.51)
  Top 0.406: v42.89,17.7 46.3,21.1 46.76,21.1 47.26,20.59 47.26,19.74 IC1.13
  Bottom 0.406: JP4.2 25.67,5.35 27.32,5.35 28.09,6.12 28.09,9.67 35.66,17.24 37.28,17.24 37.74,17.7 v42.89,17.7
PD5  (via drill 0.51)
  Top 0.254: v48.18,19.73 48.18,19.53 47.37,18.71 IC1.14
  Top 0.406: v31.31,10.59 28.75,10.59 28.09,9.93 28.09,8.53 27.58,8.02 23.64,8.02 23.01,7.39 23.01,5.73 22.24,4.97 20.72,4.97 20.34,4.59 JP4.1
  Route15 0.406: v31.31,10.59 40.46,19.73 v48.18,19.73
PD6  (via drill 0.51)
  Top 0.406: IC1.15 47.08,17.29 v45.94,17.29
  Bottom 0.406: v45.94,17.29 45.14,16.49 40.55,16.49 38.25,14.19 38.25,8.91 37.36,8.02 31.39,8.02 30.87,7.51 30.87,6.49 28.85,4.46 27.32,4.46 JP5.2
PD7  (via drill 0.51)
  Top 0.406: IC1.16 47.4,16.48 v46.96,16.48
  Bottom 0.406: JP5.1 30.25,4.85 44.72,4.85 45.87,5.99 45.87,15.39 v46.96,16.48
RESET  (via drill 0.51)
  Top 0.406: v48.99,27.25 49.18,27.25 IC1.4 | RESET.3 5.52,31.52 | 5.52,31.52 RESET.4 | v5.71,31.52 5.52,31.52
  Bottom 0.406: v48.99,27.25 48.99,28.52 40.15,37.36 13.35,37.36 7.51,31.52 v5.71,31.52 5.55,31.68 R5.1
RX
  Top 0.406: U$4.18 43.29,8.02 63.65,8.02 64.41,8.78 64.41,9.42 65.25,10.26 66.95,10.26 69.49,10.26 69.89,9.85 JTAG.6
  Bottom 0.406: U$4.18 40.79,7.98 40.79,9.67 39.52,10.94 39.52,13.95 JP1.3
TX
  Top 0.406: U$4.15 43.08,12.89 JP1.2 45.6,10.81 66.31,10.81 70,10.81 71.16,9.65 JTAG.8
VCC  (via drill 0.51)
  Top 0.406: 36.21,38.38 S2.4 23.22,34.06 | 36.21,38.38 37.23,37.36 37.23,33.56 RN1.3 | 36.21,38.38 36.21,40.52 JP3.5 | R22.2 12.4,41.61 13.43,40.58 v13.43,38.22 16.46,38.22 S1.4 16.62,34.06 | 16.62,34.06 S1.3 | 23.22,34.06 S2.3 | IC1.5 51.63,23.66 v51.63,22.57 | v51.63,22.57 55.76,22.57 IC1.38 58.99,25.8 60.88,25.8 C3.1 65.27,23.39 v66.44,23.39 | v51.63,22.57 51.63,19.58 IC1.17 47.13,15.07 C2.1 | 16.62,34.06 23.22,34.06 | LS.C 19.07,4.59 20.21,5.73 v20.21,11.32
  Route15 0.406: v52.85,12.47 54.5,10.81 67.46,10.81 68.62,9.65 JTAG.4 | v20.21,11.32 27.58,18.69 v27.58,20.34
  Bottom 0.406: F1.2 54.04,13.65 | 54.04,13.65 52.94,14.75 52.34,14.75 50.18,16.91 50.18,18.55 L1.1 49.83,20.63 49.83,20.77 | RN1.3 35.96,26.45 R10.2 | R5.2 8.53,33.93 12.82,38.22 v13.43,38.22 | 49.83,20.77 42,20.77 41.36,21.42 R10.2 | 49.83,20.77 v51.63,22.57 52.01,22.57 52.25,22.81 52.28,22.81 C4.1 | v52.85,12.47 54.04,13.65 | IC2.1 66.9,23.85 v66.44,23.39 | v27.58,20.34 27.58,21.1 27.89,21.42 R13.2 R12.2 R11.2 R10.2
  Bottom 0.508: C6.2 C7.2 C8.2 | C8.2 C9.2 C10.2 | C8.2 67.33,22.5 v66.44,23.39

### Text on the board
tNames: RESET | 0 2 4 6 / 1 3 5 7 | 3|R / T|2 | piezo | TX2 | RX2 | TX1 | RX1 | 4|6|5|7 | GND | v+ | uARM_Board
bNames: Jan Spuler / 18.02.2020 | R13 | R12 | R10